# Altium project WheelBoard.PrjPcb
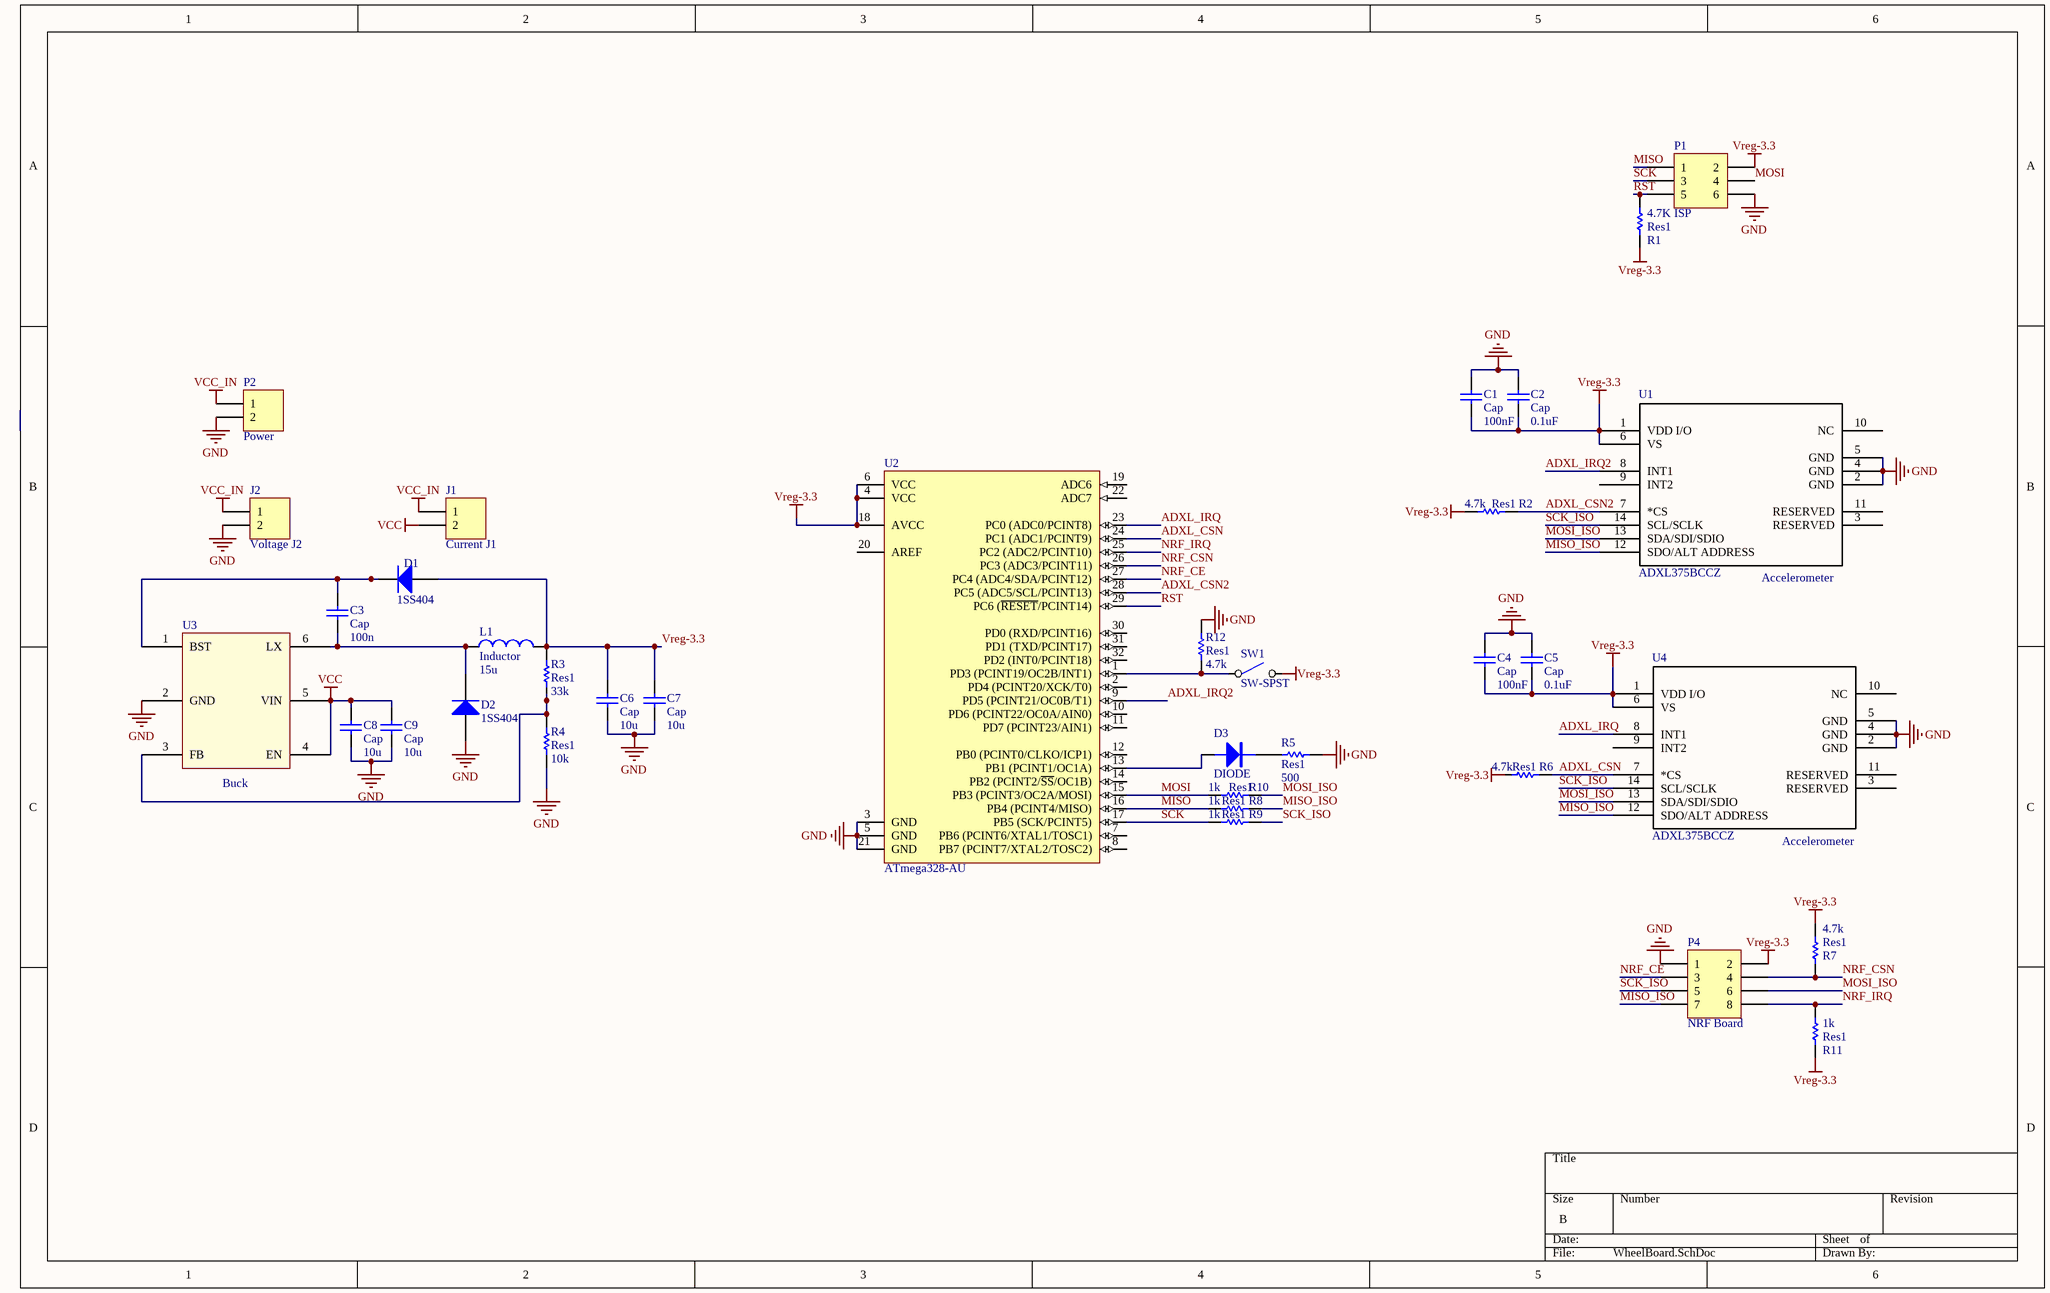
[diagram p0: WheelBoard.SchDoc]
1 sheet, 35 parts. Net scope: global (net labels, ports and power ports of the same name join across sheets).
Board files: WheelBoard.PcbDoc, PCB1.PcbDoc, WheelBoard[Conflict].PcbDoc

## Sheet WheelBoard.SchDoc
size B

### Parts
C1  Cap  value 100nF  [0603E]
C2  Cap  value 0.1uF  [0603E]
C3  Cap  value 100n  [0603E]
C4  Cap  value 100nF  [0603E]
C5  Cap  value 0.1uF  [0603E]
C6  Cap  value 10u  [C0805]
C7  Cap  value 10u  [C0805]
C8  Cap  value 10u  [C0805]
C9  Cap  value 10u  [C0805]
D1  1SS404  [SOD-323]
D2  1SS404  [SOD-323]
D3  DIODE  [D0805E]
J1  Current J1  [HDR1X2]
J2  Voltage J2  [HDR1X2]
L1  Inductor  value 15u  [5828-INDUCTOR]
P1  ISP  [HDR2X3]
P2  Power  [HDR1X2]
P4  NRF Board  [HDR2X4]
R1  Res1  value 4.7K  [0603E]
R2  Res1  value 4.7k  [0603E]
R3  Res1  value 33k  [0603E]
R4  Res1  value 10k  [0603E]
R5  Res1  value 500  [0603E]
R6  Res1  value 4.7k  [0603E]
R7  Res1  value 4.7k  [0603E]
R8  Res1  value 1k  [0603E]
R9  Res1  value 1k  [0603E]
R10  Res1  value 1k  [0603E]
R11  Res1  value 1k  [0603E]
R12  Res1  value 4.7k  [0603E]
SW1  SW-SPST  [Switch - SMD]
U1  ADXL375BCCZ  [LGA_CC-14-1]
U2  ATmega328-AU  [32A_N]
U3  Buck  [SOT23-6]
U4  ADXL375BCCZ  [LGA_CC-14-1]

### Nets
GND: C1.2 C2.2 C4.2 C5.2 C6.1 C7.1 C8.2 C9.2 D2.2(A) J2.2 P1.6 P2.2 P4.1 R4.1 R5.2 R12.2 U1.2(GND) U1.4(GND) U1.5(GND) U2.3(GND) U2.5(GND) U2.21(GND) U3.2(GND) U4.2(GND) U4.4(GND) U4.5(GND)
VCC: C8.1 C9.1 J1.2 U3.4(EN) U3.5(VIN)
VCC_IN: J1.1 J2.1 P2.1
Vreg-3.3: C1.1 C2.1 C4.1 C5.1 C6.2 C7.2 D1.2(A) L1.2 P1.2 P4.2 R1.2 R2.1 R3.2 R7.2 R11.2 SW1.2 U1.1(VDD_I/O) U1.6(VS) U2.4(VCC) U2.6(VCC) U2.18(AVCC) U4.1(VDD_I/O) U4.6(VS)
ADXL_CSN: R6.2 U2.24(PC1_(ADC1/PCINT9)) U4.7(*CS)
ADXL_CSN2: R2.2 U1.7(*CS) U2.28(PC5_(ADC5/SCL/PCINT13))
ADXL_IRQ: U2.23(PC0_(ADC0/PCINT8)) U4.8(INT1)
ADXL_IRQ2: U1.8(INT1) U2.9(PD5_(PCINT21/OC0B/T1))
MISO: P1.1 R8.1 U2.16(PB4_(PCINT4/MISO))
MISO_ISO: P4.7 R8.2 U1.12(SDO/ALT_ADDRESS) U4.12(SDO/ALT_ADDRESS)
MOSI: P1.4 R10.2 U2.15(PB3_(PCINT3/OC2A/MOSI))
MOSI_ISO: P4.6 R10.1 U1.13(SDA/SDI/SDIO) U4.13(SDA/SDI/SDIO)
NRF_CE: P4.3 U2.27(PC4_(ADC4/SDA/PCINT12))
NRF_CSN: P4.4 R7.1 U2.26(PC3_(ADC3/PCINT11))
NRF_IRQ: P4.8 R11.1 U2.25(PC2_(ADC2/PCINT10))
RST: P1.5 R1.1 U2.29(PC6_(~{RESET}/PCINT14))
SCK: P1.3 R9.1 U2.17(PB5_(SCK/PCINT5))
SCK_ISO: P4.5 R9.2 U1.14(SCL/SCLK) U4.14(SCL/SCLK)
NetC3_1: C3.1 D1.1(K) U3.1(BST)
NetC3_2: C3.2 D2.1(K) L1.1 U3.6(LX)
NetD3_A: D3.A U2.13(PB1_(PCINT1/OC1A))
NetD3_K: D3.K R5.1
NetR3_1: R3.1 R4.2 U3.3(FB)
NetR12_1: R12.1 SW1.1 U2.1(PD3_(PCINT19/OC2B/INT1))

Not connected (* = marked no-connect by the designer): R6 1; U1 3(RESERVED) 9(INT2) 10(NC) 11(RESERVED); U2 2(PD4_(PCINT20/XCK/T0)) 7(PB6_(PCINT6/XTAL1/TOSC1)) 8(PB7_(PCINT7/XTAL2/TOSC2)) 10(PD6_(PCINT22/OC0A/AIN0)) 11(PD7_(PCINT23/AIN1)) 12(PB0_(PCINT0/CLKO/ICP1)) 14(PB2_(PCINT2/~{SS}/OC1B)) 19(ADC6) 20(AREF) 22(ADC7) 30(PD0_(RXD/PCINT16)) 31(PD1_(TXD/PCINT17)) 32(PD2_(INT0/PCINT18)); U4 3(RESERVED) 9(INT2) 10(NC) 11(RESERVED)

### Notes on the sheet
- (near U1) Accelerometer
- (near U4) Accelerometer
- Labels drawn without touching a wire or pin: Vreg-3.3

### Library data of the parts
C1-C9 = Cap: Capacitor; Published: 8-Jun-2000; LatestRevisionDate: 17-Jul-2002; LatestRevisionNote: Re-released for DXP Platform.; PackageReference: RAD-0.3; Publisher: Altium Limited; PackageDescription: Radial Cap, Thru-Hole; 2 Leads; 0.3 in Pin Spacing
D1 D2 = BA592: Silicon RF Switching Diode for VHF Band Switching in TV/VTR Tuners; Published: 21-Mar-2003; LatestRevisionDate: 19-Mar-2004; LatestRevisionNote: Silkscreen size reduced.; DatasheetDocument: Oct-1999; PackageDocument: Sep-2000; PackageReference: SOD-323; Publisher: Altium Limited; ComponentLink1Description: Manufacturer Link; ComponentLink1URL: http://www.infineon.com/; ComponentLink2Description: Datasheet; ComponentLink2URL: http://www.infineon.com/upload/Document/cmc_upload/documents/080/120/ba592_ba892series_1.pdf
J1 J2 P2 = Header 2: Header, 2-Pin; LatestRevisionDate: 17-Jul-2002; LatestRevisionNote: Re-released for DXP Platform.; Publisher: Altium Limited
L1 = Inductor: Code_IEC: 1005; Published: 8-Jun-2000; LatestRevisionDate: 29-May-2009; LatestRevisionNote: IPC-7351 Footprint Added.; PackageReference: 0402-A; Publisher: Altium Limited; PackageDescription: Chip Inductor; Code_JEITA: 0402
P1 = Header 3X2: Header, 3-Pin, Dual row; LatestRevisionDate: 17-Jul-2002; LatestRevisionNote: Re-released for DXP Platform.; Publisher: Altium Limited
P4 = Header 4X2: Header, 4-Pin, Dual row; LatestRevisionDate: 17-Jul-2002; LatestRevisionNote: Re-released for DXP Platform.; Publisher: Altium Limited
R1-R12 = Res1: Resistor; Published: 8-Jun-2000; LatestRevisionDate: 17-Jul-2002; LatestRevisionNote: Re-released for DXP Platform.; PackageReference: AXIAL-0.3; Publisher: Altium Limited; PackageDescription: Axial Device, Thru-Hole; 2 Leads; 0.3 in Pin Spacing
U1 U4 = ADXL345BCCZ: Imported; RefDes: RefDes; Type: DEV; Value: Value
U2 = ATmega328-AU: 8-bit AVR Microcontroller, 32KB Flash, 1KB EEPROM, 2KB SRAM, 32-pin TQFP, Industrial Grade (-40°C to 85°C); Published: 1-Apr-2010; DatasheetVersion: revA, Jan-2010; PackageVersion: revB, Oct-2001; PackageReference: 32A; Publisher: Altium Limited; PackageDescription: 32-Lead, 7x7x1.0 mm Body, 0.8mm Lead Pitch, Thin Profile Plastic Quad Flat Package (TQFP); Supplier 1: Digi-Key; Supplier Part Number 1: ATMEGA328-AU-ND; Supplier 2: Mouser; Supplier Part Number 2: 556-ATMEGA328-AU; Code_JEDEC: MS-026-ABA; ComponentLink1Description: Manufacturer Link; ComponentLink1URL: http://www.atmel.com/products/avr/default.asp?; ComponentLink2Description: ATmega48A/48PA/88A/88PA/168A/168PA/328/328P Datasheet; ComponentLink2URL: http://www.atmel.com/dyn/resources/prod_documents/8271.pdf; ComponentLink3Description: ATmega48A/48PA/88A/88PA/168A/168PA/328/328P Summary; ComponentLink3URL: http://www.atmel.com/dyn/resources/prod_documents/8271S.pdf; ComponentLink4Description: Atmel.com Home; ComponentLink4URL: http://www.atmel.com
U3 = Component_1